# EAGLE schematic bugs (EAGLE 9.6.2)
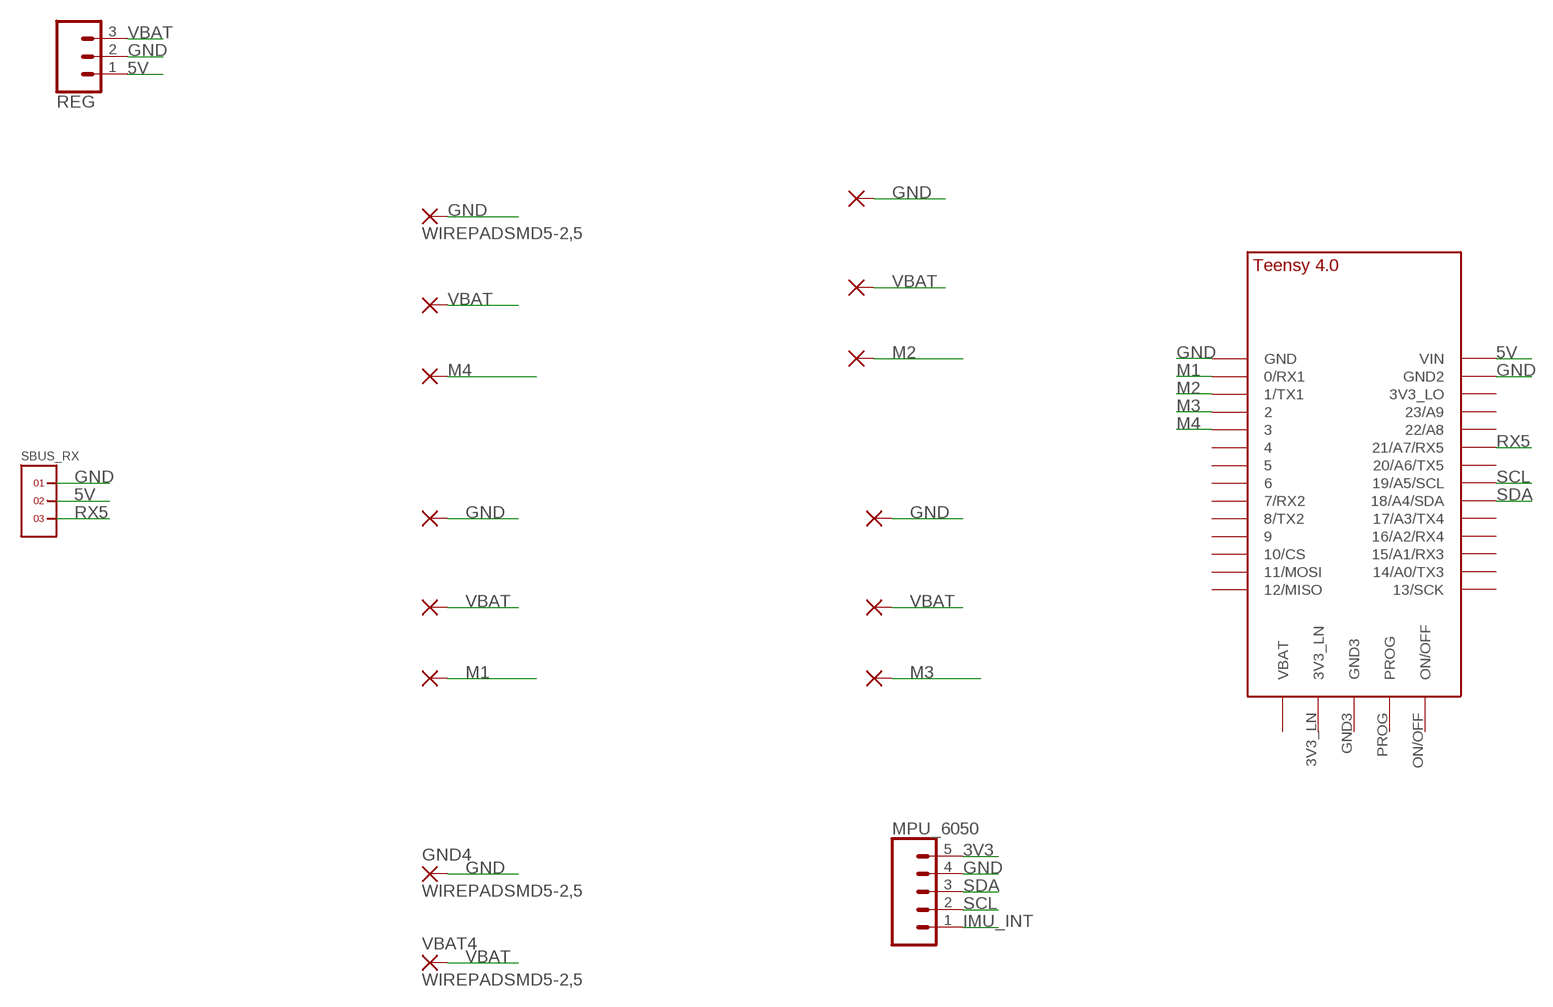
[diagram p0: schematic, sheet 1]

## Parts
GND  WIREPADSMD5-2,5  [5-2,5]
GND1  WIREPADSMD5-2,5  [5-2,5]
GND2  WIREPADSMD5-2,5  [5-2,5]
GND3  WIREPADSMD5-2,5  [5-2,5]
GND4  WIREPADSMD5-2,5  [5-2,5]
M1  WIREPADSMD5-2,5  [5-2,5]
M2  WIREPADSMD5-2,5  [5-2,5]
M3  WIREPADSMD5-2,5  [5-2,5]
M4  WIREPADSMD5-2,5  [5-2,5]
MPU_6050  CONN_05NO_SILK  [1X05_NO_SILK]
REG  REG  CONN_031X03_NO_SILK  [1X03_NO_SILK]
SBUS_RX  1X3  [1X3]
U$1  TEENSY_4.0  [TEENSY_4.0]
VBAT  WIREPADSMD5-2,5  [5-2,5]
VBAT1  WIREPADSMD5-2,5  [5-2,5]
VBAT2  WIREPADSMD5-2,5  [5-2,5]
VBAT3  WIREPADSMD5-2,5  [5-2,5]
VBAT4  WIREPADSMD5-2,5  [5-2,5]

## Nets
3V3: MPU_6050.5
5V: REG.1 SBUS_RX.2 U$1.VIN
GND: GND1.1(P) GND2.1(P) GND3.1(P) GND4.1(P) GND.1(P) MPU_6050.4 REG.2 SBUS_RX.1 U$1.GND U$1.GND2
IMU_INT: MPU_6050.1
M1: M1.1(P) U$1.0/RX(0/RX1)
M2: M2.1(P) U$1.1/TX(1/TX1)
M3: M3.1(P) U$1.2
M4: M4.1(P) U$1.3/CANTX
RX5: SBUS_RX.3 U$1.21/A7(21/A7/RX5)
SCL: MPU_6050.2 U$1.19/A5/SCL
SDA: MPU_6050.3 U$1.18/A4/SDA
VBAT: REG.3 VBAT1.1(P) VBAT2.1(P) VBAT3.1(P) VBAT4.1(P) VBAT.1(P)
Unconnected: U$1.3V3_LN U$1.3V3_LO U$1.4/CANRX U$1.5 U$1.6 U$1.7(7/RX2) U$1.8(8/TX2) U$1.9/CS U$1.10/CS U$1.11/MOSI U$1.12/MISO U$1.13/SCK U$1.14/A0(14/A0/TX3) U$1.15/A1(15/A1/RX3) U$1.16/A2(16/A2/RX4) U$1.17/A3(17/A3/TX4) U$1.20/A6(20/A6/TX5) U$1.22/A8 U$1.23/A9 U$1.GND3 U$1.ON/OFF U$1.PROG U$1.VBAT\(VBAT)

## Library data of the parts
GND GND1-GND4 M1-M4 VBAT VBAT1-VBAT4 = wirepad:WIREPAD: Wire PAD connect wire on PCB
MPU_6050 = SparkFun-Connectors:CONN_05: Multi connection point. Often used as Generic Header-pin footprint for 0.1 inch spaced/style header connections On any of the 0.1 inch spaced packages, you can populate with these: Break Away Headers - Straight <https://www.sparkfun.com/products/116> (PRT-00116) Break Away Male Headers - Right Angle <https://www.sparkfun.com/products/553> (PRT-00553) Female Headers <https://www.sparkfun.com/products/115> (PRT-00115) Break Away Headers - Machine Pin <https://www.sparkfun.com/products/117> (PRT-00117) Break Away Female Headers - Swiss Machine Pin <https://www.sparkfun.com/products/743> (PRT-00743) For SCREWTERMINALS and SPRING TERMINALS visit here: Screw Terimnals on SparkFun.com <https://www.sparkfun.com/search/results?term=Screw+Terminals> (5mm/3.5mm/2.54mm spacing) This device is also useful as a general connection point to wire up your design to another part of your project. Our various solder wires solder well into these plated through hole pads. Hook-Up Wire - Assortment (Stranded, 22 AWG) <https://www.sparkfun.com/products/11375> (PRT-11375) Hook-Up Wire - Assortment (Solid Core, 22 AWG) <https://www.sparkfun.com/products/11367> (PRT-11367) View the entire wire category on our website here <https://www.sparkfun.com/categories/141> Special notes: Molex polarized connector foot print use with SKU : PRT-08231 with associated crimp pins and housings. 1MM SMD Version SKU: PRT-10208
REG = SparkFun-Connectors:CONN_03: Multi connection point. Often used as Generic Header-pin footprint for 0.1 inch spaced/style header connections On any of the 0.1 inch spaced packages, you can populate with these: Break Away Headers - Straight <https://www.sparkfun.com/products/116> (PRT-00116) Break Away Male Headers - Right Angle <https://www.sparkfun.com/products/553> (PRT-00553) Female Headers <https://www.sparkfun.com/products/115> (PRT-00115) Break Away Headers - Machine Pin <https://www.sparkfun.com/products/117> (PRT-00117) Break Away Female Headers - Swiss Machine Pin <https://www.sparkfun.com/products/743> (PRT-00743) Stackable Header - 3 Pin (Female, 0.1") <https://www.sparkfun.com/products/13875> (PRT-13875) For SCREWTERMINALS and SPRING TERMINALS visit here: Screw Terimnals on SparkFun.com <https://www.sparkfun.com/search/results?term=Screw+Terminals> (5mm/3.5mm/2.54mm spacing) This device is also useful as a general connection point to wire up your design to another part of your project. Our various solder wires solder well into these plated through hole pads. Hook-Up Wire - Assortment (Stranded, 22 AWG) <https://www.sparkfun.com/products/11375> (PRT-11375) Hook-Up Wire - Assortment (Solid Core, 22 AWG) <https://www.sparkfun.com/products/11367> (PRT-11367) View the entire wire category on our website here <https://www.sparkfun.com/categories/141> Special notes: Molex polarized connector foot print use with SKU : PRT-08232 with associated crimp pins and housings.
SBUS_RX = headers(2mm):1X3
U$1 = TEENSY 4.0:TEENSY_4.0